# Altium project SLowDanceTop.PrjPcb
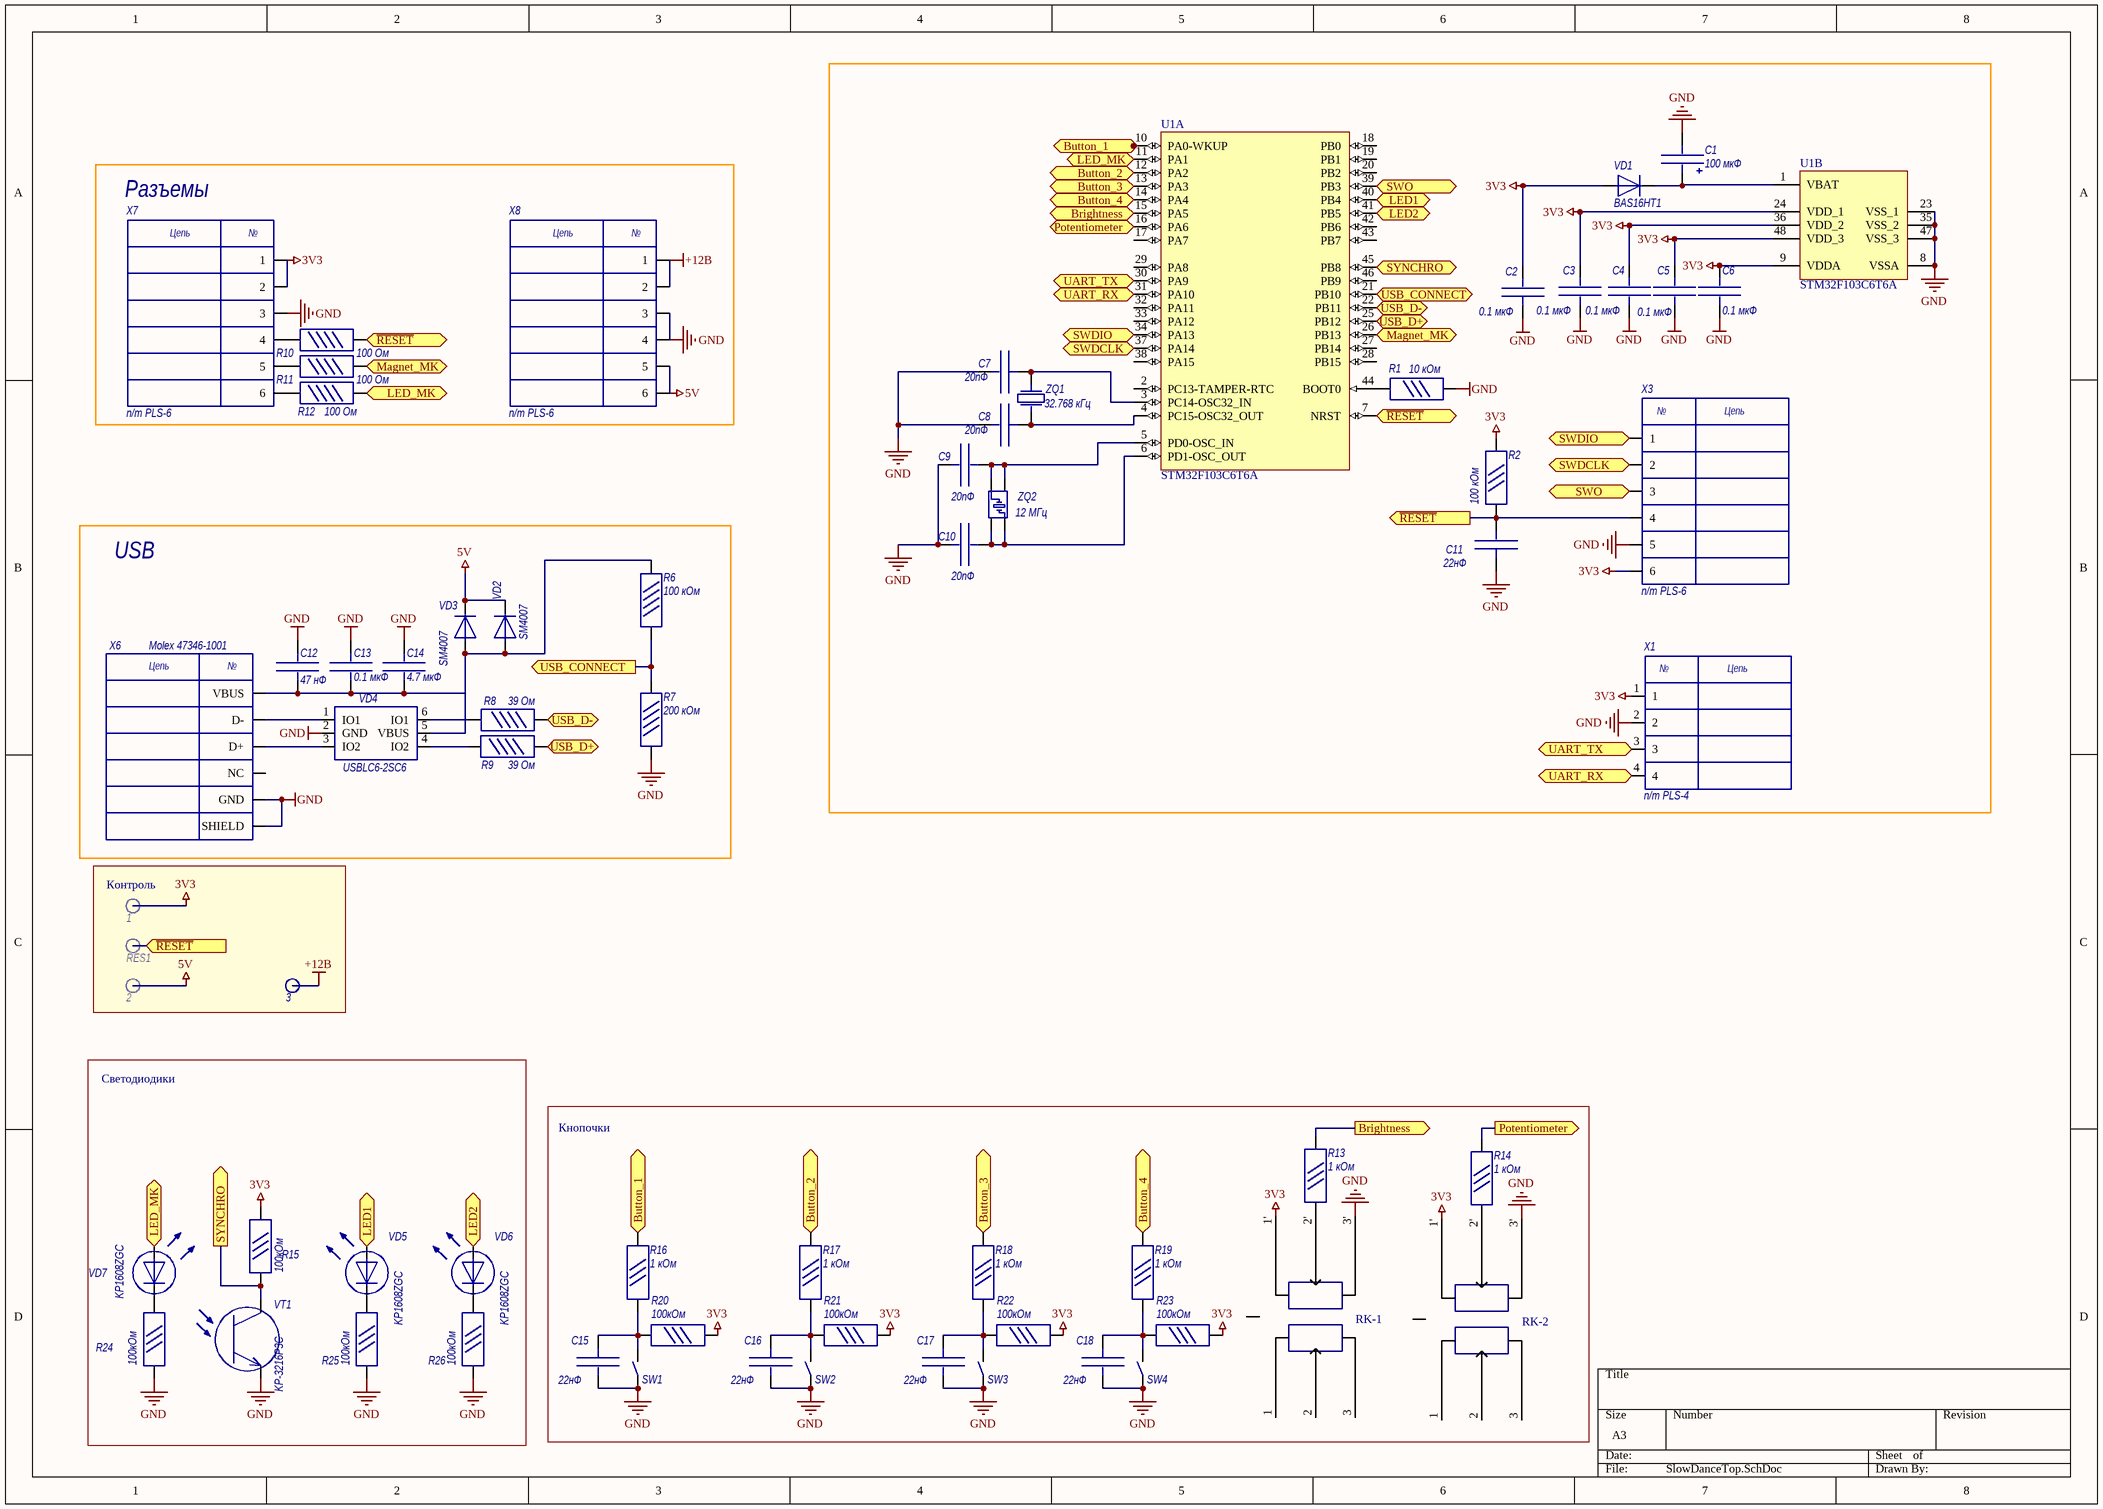
[diagram p0: SlowDanceTop.SchDoc]
1 sheet, 67 parts. Net scope: flat (ports and power ports of the same name join across sheets).
Board file: SlowDanceTop.PcbDoc

## Sheet SlowDanceTop.SchDoc
size A3

### Parts
1  Rep Point Small  [RP2 (small)]  (value not drawn)
2  Rep Point Small  [RP2 (small)]  (value not drawn)
3  Rep Point Small  [RP2 (small)]  (value not drawn)
C1  value 100 мкФ  [CAP_POL_SIZE_B]  (hidden comment: Tann B 100 мкФ 6 В)
C2  value 0.1 мкФ  [C0603_HD]  (hidden comment: C0603-X7R-50В-0.1мкФ)
C3  value 0.1 мкФ  [C0603_HD]  (hidden comment: C0603-X7R-50В-0.1мкФ)
C4  value 0.1 мкФ  [C0603_HD]  (hidden comment: C0603-X7R-50В-0.1мкФ)
C5  value 0.1 мкФ  [C0603_HD]  (hidden comment: C0603-X7R-50В-0.1мкФ)
C6  value 0.1 мкФ  [C0603_HD]  (hidden comment: C0603-X7R-50В-0.1мкФ)
C7  value 20пФ  [C0402_HD]  (hidden comment: C0402-X7R-16В-20pF-10%)
C8  value 20пФ  [C0402_HD]  (hidden comment: C0402-X7R-16В-20pF-10%)
C9  value 20пФ  [C0402_HD]  (hidden comment: C0402-X7R-16В-20pF-10%)
C10  value 20пФ  [C0402_HD]  (hidden comment: C0402-X7R-16В-20pF-10%)
C11  value 22нФ  [C0603_HD]  (hidden comment: C0603-X5R-16В-22нФ)
C12  value 47 нФ  [C0402_min]  (hidden comment: C0402-X7R-10В-47нФ)
C13  value 0.1 мкФ  [C0402_min]  (hidden comment: C0402-X7R-16В-0.1мкФ)
C14  value 4.7 мкФ  [C0603_HD]  (hidden comment: C0603-X5R-6.3В-4.7мкФ±20%)
C15  value 22нФ  [C0603_HD]  (hidden comment: C0603-X5R-16В-22нФ)
C16  value 22нФ  [C0603_HD]  (hidden comment: C0603-X5R-16В-22нФ)
C17  value 22нФ  [C0603_HD]  (hidden comment: C0603-X5R-16В-22нФ)
C18  value 22нФ  [C0603_HD]  (hidden comment: C0603-X5R-16В-22нФ)
R1  value 10 кОм  [R0603_HD]  (hidden comment: R0603-10кОм-5%)
R2  value 100 кОм  [R0603_HD]  (hidden comment: R0603-100кОм-5%)
R6  value 100 кОм  [R0402_min]  (hidden comment: R0402-100кОм-5%)
R7  value 200 кОм  [R0402_min]  (hidden comment: R0402-000кОм-5%)
R8  value 39 Ом  [R0402_min]  (hidden comment: R0402-39Ом-5%)
R9  value 39 Ом  [R0402_min]  (hidden comment: R0402-39Ом-5%)
R10  value 100 Ом  [R0402_min]  (hidden comment: R0402-100Ом-5%)
R11  value 100 Ом  [R0402_min]  (hidden comment: R0402-100Ом-5%)
R12  value 100 Ом  [R0402_min]  (hidden comment: R0402-100Ом-5%)
R13  value 1 кОм  [R0603_HD]  (hidden comment: R0603-1кОм-5%)
R14  value 1 кОм  [R0603_HD]  (hidden comment: R0603-1кОм-5%)
R15  value 100кОм  [R0603_HD]  (hidden comment: R0603-100кОм-5%)
R16  value 1 кОм  [R0603_HD]  (hidden comment: R0603-1кОм-5%)
R17  value 1 кОм  [R0603_HD]  (hidden comment: R0603-1кОм-5%)
R18  value 1 кОм  [R0603_HD]  (hidden comment: R0603-1кОм-5%)
R19  value 1 кОм  [R0603_HD]  (hidden comment: R0603-1кОм-5%)
R20  value 100кОм  [R0603_HD]  (hidden comment: R0603-100кОм-5%)
R21  value 100кОм  [R0603_HD]  (hidden comment: R0603-100кОм-5%)
R22  value 100кОм  [R0603_HD]  (hidden comment: R0603-100кОм-5%)
R23  value 100кОм  [R0603_HD]  (hidden comment: R0603-100кОм-5%)
R24  value 100кОм  [R0603_HD]  (hidden comment: R0603-100кОм-5%)
R25  value 100кОм  [R0603_HD]  (hidden comment: R0603-100кОм-5%)
R26  value 100кОм  [R0603_HD]  (hidden comment: R0603-100кОм-5%)
RES1  Rep Point Small  [RP2 (small)]  (value not drawn)
RK-1  RK-1412G-A100K  [RK-1412G]  (value not drawn)
RK-2  RK-1412G-A100K  [RK-1412G]  (value not drawn)
SW1  SWT-30  [SWT-30]  (value not drawn)
SW2  SWT-30  [SWT-30]  (value not drawn)
SW3  SWT-30  [SWT-30]  (value not drawn)
SW4  SWT-30  [SWT-30]  (value not drawn)
U1  STM32F103C6T6A  [STM-LQFP48_N]  (parts A,B of 2)
VD1  BAS16HT1  [SOD323 (SC-76)]
VD2  SM4007  [DO-213AB_]
VD3  SM4007  [DO-213AB_]
VD4  USBLC6-2SC6  [SOT23-6L (ST)]
VD5  KP1608ZGC  [LED_0603]
VD6  KP1608ZGC  [LED_0603]
VD7  KP1608ZGC  [LED_0603]
VT1  KP-3216P3C  [photocell_1206]
X1  n/m PLS-4  [PLS2-4]
X3  n/m PLS-6  [PLS-06]
X6  Molex 47346-1001  [MicroUSB 047346-0001 Molex]
X7  n/m PLS-6  [PLS-06]
X8  n/m PLS-6  [PLS-06]
ZQ1  value 32.768 кГц  [DST310S]  (hidden comment: DST310S 32.768 kHz, 20ppm, 50 kOhm, 7pF (1TJF0SPDJ1AI00D))
ZQ2  value 12 МГц  [DSX321G]  (hidden comment: DSX321G 12 MHz, 10ppm@25C, 20ppm@-40+85C, 80 Ohm, 12pF (1C212000AB0AB))

### Blocks framed on the sheet
Разъемы: R10-R12 X7 X8
USB: C12-C14 R6-R9 VD2-VD4 X6
Контроль: 1-3 RES1
Светодиодики: R15 R24-R26 VD5-VD7 VT1
Кнопочки: C15-C18 R13 R14 R16-R23 RK-1 RK-2 SW1-SW4

### Ports
Brightness (in), Brightness (out), Button_1, Button_1 (out), Button_2 (in), Button_2 (out), Button_3 (in), Button_3 (out), Button_4 (in), Button_4 (out), LED1 (in), LED1 (out), LED2 (in), LED2 (out), LED_MK (in), LED_MK (out), Magnet_MK (in), Magnet_MK (out), Potentiometer (in), Potentiometer (out), SWDCLK, SWDIO, SWO, SYNCHRO (in), SYNCHRO (out), UART_RX (in), UART_RX (out), UART_TX (in), UART_TX (out), USB_CONNECT (out), USB_D+ (bidir), USB_D- (bidir), ~{RESET} (in), ~{RESET} (out)

### Nets
3V3: C2.1 C3.1 C4.1 C5.1 C6.1 R2.1 R15.2 R20.1 R21.1 R22.1 R23.1 RK-1.1' RK-2.1' U1.9(VDDA) U1.24(VDD_1) U1.36(VDD_2) U1.48(VDD_3) VD1.1(A) X1.1 X3.6 X7.1 X7.2
5V: VD2.2(K) VD3.2(K) X8.5 X8.6
+12В: X8.1 X8.2
GND: C1.2(-) C2.2 C3.2 C4.2 C5.2 C6.2 C7.2 C8.2 C9.2 C10.2 C11.2 C12.2 C13.1 C14.2 C15.2 C16.2 C17.2 C18.2 R1.1 R7.2 R24.1 R25.1 R26.1 RK-1.3' RK-2.3' SW1.1 SW2.1 SW3.1 SW4.1 U1.8(VSSA) U1.23(VSS_1) U1.35(VSS_2) U1.47(VSS_3) VD4.2(GND) VT1.1(E) X1.2 X3.5 X6.5(GND) X6.6(SHIELD) X7.3 X8.3 X8.4
NetC1_1: C1.1(+) U1.1(VBAT) VD1.2(K)
NetC7_1: C7.1 U1.3(PC14-OSC32_IN) ZQ1.1
NetC8_1: C8.1 U1.4(PC15-OSC32_OUT) ZQ1.2
NetC9_1: C9.1 U1.5(PD0-OSC_IN) ZQ2.2 ZQ2.3
NetC10_1: C10.1 U1.6(PD1-OSC_OUT) ZQ2.1 ZQ2.4
NetC11_1: C11.1 R2.2 R10.2 U1.7(NRST) X3.4 ; port ~{RESET}
NetC12_1: C12.1 C13.2 C14.1 R6.1 VD2.1(A) VD3.1(A) VD4.5(VBUS) X6.1(VBUS)
NetC15_1: C15.1 R16.2 R20.2 SW1.2
NetC16_1: C16.1 R17.2 R21.2 SW2.2
NetC17_1: C17.1 R18.2 R22.2 SW3.2
NetC18_1: C18.1 R19.2 R23.2 SW4.2
NetR1_2: R1.2 U1.44(BOOT0)
NetR6_2: R6.2 R7.1 U1.21(PB10) ; port USB_CONNECT
NetR8_1: R8.1 U1.22(PB11) ; port USB_D-
NetR8_2: R8.2 VD4.6(IO1)
NetR9_1: R9.1 VD4.4(IO2)
NetR9_2: R9.2 U1.25(PB12) ; port USB_D+
NetR10_1: R10.1 X7.4
NetR11_1: R11.1 X7.5
NetR11_2: R11.2 U1.26(PB13) ; port Magnet_MK
NetR12_1: R12.1 X7.6
NetR12_2: R12.2 U1.11(PA1) VD7.1(A) ; port LED_MK
NetR13_1: R13.1 U1.15(PA5) ; port Brightness
NetR13_2: R13.2 RK-1.2'
NetR14_1: R14.1 U1.16(PA6) ; port Potentiometer
NetR14_2: R14.2 RK-2.2'
NetR15_1: R15.1 U1.45(PB8) VT1.2(C) ; port SYNCHRO
NetR16_1: R16.1 ; port Button_1
NetR17_1: R17.1 U1.12(PA2) ; port Button_2
NetR18_1: R18.1 U1.13(PA3) ; port Button_3
NetR19_1: R19.1 U1.14(PA4) ; port Button_4
NetR24_2: R24.2 VD7.2(C)
NetR25_2: R25.2 VD5.2(C)
NetR26_2: R26.2 VD6.2(C)
NetU1_30: U1.30(PA9) X1.3 ; port UART_TX
NetU1_31: U1.31(PA10) X1.4 ; port UART_RX
NetU1_34: U1.34(PA13) X3.1 ; port SWDIO
NetU1_37: U1.37(PA14) X3.2 ; port SWDCLK
NetU1_39: U1.39(PB3) X3.3 ; port SWO
NetU1_40: U1.40(PB4) VD5.1(A) ; port LED1
NetU1_41: U1.41(PB5) VD6.1(A) ; port LED2
NetVD4_1: VD4.1(IO1) X6.2(D-)
NetVD4_3: VD4.3(IO2) X6.3(D+)

Not connected (* = marked no-connect by the designer): RK-1 1 2 3 4; RK-2 1 2 3 4; U1 2(PC13-TAMPER-RTC) 10(PA0-WKUP) 17(PA7) 18(PB0) 19(PB1) 20(PB2) 27(PB14) 28(PB15) 29(PA8) 32(PA11) 33(PA12) 38(PA15) 42(PB6) 43(PB7) 46(PB9); X6 4(NC)

### Notes on the sheet
- (in symbol MicroUSB 047346-0001 Molex) Цепь; №
- (in symbol PLS2-4) №; Цепь
- (in symbol PLS-6) №; Цепь

### Library data of the parts
C1 = CAP_TANT_B
C2-C6 C12 C13 = C0603
C7-C10 = C0402
C11 C14-C18 = C0603_HD
R1 R2 R13-R26 = R0603
R6-R12 = R0402
RK-1 RK-2 = RK-1412G: Resistance: 0-100 кОм; Rated power: 50 мВт; Operation voltage (AC only): 50В; Total rot.angle: 300
U1 = STM32F103C6T6A: ARM Cortex-M3 32-bit MCU, 32 KB Flash, 10 KB Internal RAM, 37 I/Os, 48-pin LQFP, -40 to 85 degC, Tray; A/D Converter: 2x12-bit (10 Channel); FLASH Size (Prog) (kB): 32; I/Os (High Current): 37; Internal RAM Size (kB): 10; Operating Frequency(F) (Processor speed) (MHz): 72; Supply Voltage(Vcc) min (V): 2; DatasheetVersion: Rev. 6; PackageVersion: Rev. 6, 06/2013; PackageReference: LQFP48; PackageDescription: 48-Pin Low Profile Quad Flat Package, 7 x 7 mm Body, 0.5 mm Pitch; Supplier 1: Digi-Key; Supplier Part Number 1: 497-11515-ND; Supplier 2: Farnell; Supplier Part Number 2: 1972391; Supplier 3: Newark; Supplier Part Number 3: 72T2643; Supplier 4: Newark; Supplier Part Number 4: 57P1219; Supplier 5: Mouser; Supplier Part Number 5: 511-STM32F103C6T6A; Core: ARM Cortex-M3; Packing: Tray; Mounting Technology: Surface Mount; PartNumber: STM32F103C6T6A; ComponentLink1Description: Manufacturer URL; ComponentLink1URL: http://www.st.com/web/en/home.html; ComponentLink2Description: Datasheet; ComponentLink2URL: http://www.st.com/st-web-ui/static/active/en/resource/technical/document/datasheet/CD00210843.pdf; ComponentLink3Description: Package Specification; ComponentLink3URL: http://www.st.com/st-web-ui/static/active/en/resource/technical/document/datasheet/DM00058181.pdf
VD1 = BAS16H
VD2 VD3 = SM400x
VD5-VD7 = LED_0603
X1 = PLS2-4
X3 X7 X8 = PLS-6
X6 = MicroUSB 047346-0001 Molex
ZQ2 = DSX321G